# Altium schematic sheet BlockPowerSupply.SchDoc: Block_PowerSupply
size A3; Organization: Institut d'Automatisation Industrielle; SheetNumber: 3; SheetTotal: 8; SVN: OUI; CurrentTime: 6; CurrentDate: 5; DocumentFullPathAndName: 8; DocumentName: 9; ModifiedDate: 13; ProjectName: <projet>
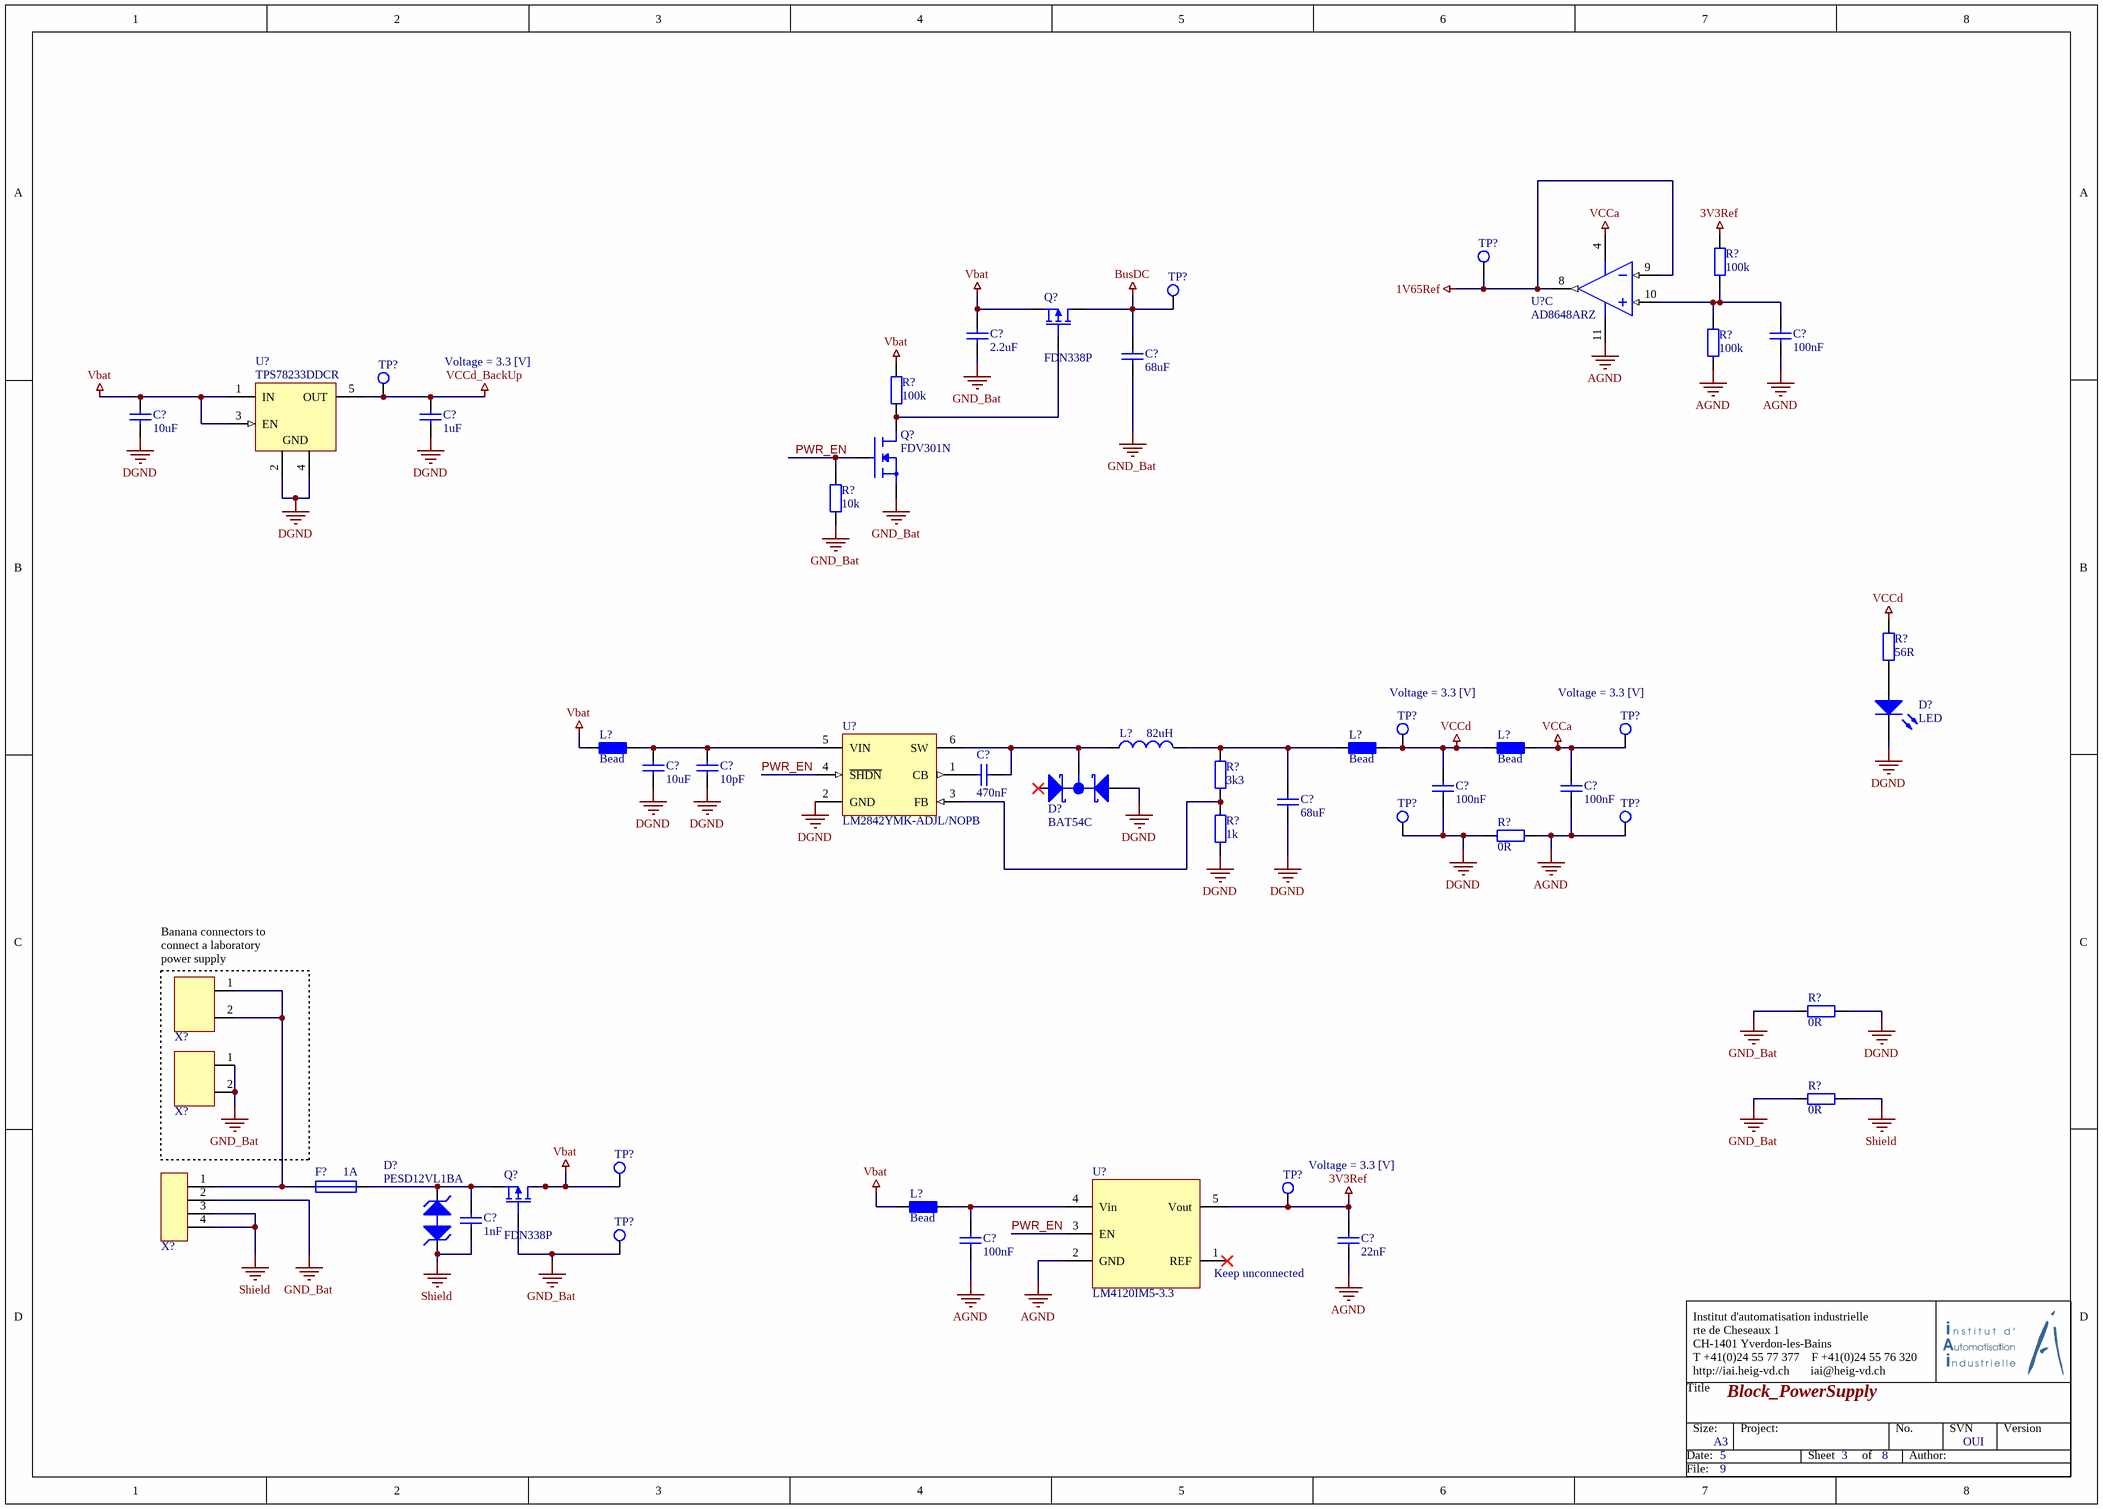
[diagram p0: BlockPowerSupply.SchDoc]

## Parts
(Parts that share a designator on the sheet are numbered #1, #2 ... from top to bottom, then left to right.)
C?#1  2.2uF  [CAPC2012N]
C?#2  100nF  [CAPC2012N]
C?#3  68uF  [CAP1206]
C?#4  10uF  [CAP1206]
C?#5  1uF  [CAPC2012N]
C?#6  470nF  [CAPC2012N]
C?#7  10uF  [CAP1206]
C?#8  10pF  [CAPC2012N]
C?#9  100nF  [CAPC2012N]
C?#10  100nF  [CAPC2012N]
C?#11  68uF  [CAP1206]
C?#12  1nF  [CAPC2012N]
C?#13  100nF  [CAPC2012N]
C?#14  22nF  [CAPC2012N]
D?#1  LED  [LED2012N]
D?#2  BAT54C  [SOT23-3N]
D?#3  PESD12VL1BA  [SOD323]
F?  1A  [RESC2012N]
L?#1  Bead  [RESC2012N]
L?#2  82uH  [SRR1260A-820MC]
L?#3  Bead  [RESC2012N]
L?#4  Bead  [RESC2012N]
L?#5  Bead  [RESC2012N]
Q?#1  FDN338P  [SOT23-3N]
Q?#2  FDV301N  [SOT23-3N]
Q?#3  FDN338P  [SOT23-3N]
R?#1  100k  [RESC2012N]
R?#2  100k  [RESC2012N]
R?#3  100k  [RESC2012N]
R?#4  10k  [RESC2012N]
R?#5  56R  [RESC2012N]
R?#6  3k3  [RESC2012N]
R?#7  1k  [RESC2012N]
R?#8  0R  [RESC2012N]
R?#9  0R  [RESC2012N]
R?#10  0R  [RESC2012N]
TP?#1  TP  [Testpoint]  (value not drawn)
TP?#2  TP  [Testpoint]  (value not drawn)
TP?#3  TP  [Testpoint]  (value not drawn)
TP?#4  TP  [Testpoint]  (value not drawn)
TP?#5  TP  [Testpoint]  (value not drawn)
TP?#6  TP  [Testpoint]  (value not drawn)
TP?#7  TP  [Testpoint]  (value not drawn)
TP?#8  TP  [Testpoint]  (value not drawn)
TP?#9  TP  [Testpoint]  (value not drawn)
TP?#10  TP  [Testpoint]  (value not drawn)
U?#1  AD8648ARZ  [ADI-R-14_M]  (part C of 4)
U?#2  TPS78233DDCR  [SOT-23-5]
U?#3  LM2842YMK-ADJL/NOPB  [SOT-23-6]
U?#4  LM4120IM5-3.3  [SOT-23-5]
X?#1  Fiche Banane Rouge 4mm  [BANANE]  (value not drawn)
X?#2  Fiche Banane Noire 4mm  [BANANE]  (value not drawn)
X?#3  MicroMatch4p  [MicroMatch4p]  (value not drawn)

## Nets
1V65Ref: TP?#1.1 U?#1.8(OUT_C) U?#1.9(-IN_C)
3V3Ref: C?#14.2 R?#1.2 TP?#9.1 U?#4.5(Vout)
AGND: C?#2.1 C?#10.1 C?#13.1 C?#14.1 R?#2.1 R?#8.2 TP?#7.1 U?#1.11(-V) U?#4.2(GND)
BusDC: C?#3.2 Q?#1.3(D) TP?#2.1
DGND: C?#4.1 C?#5.1 C?#7.1 C?#8.1 C?#9.1 C?#11.1 D?#1.2(K) D?#2.2(A2) R?#7.2 R?#8.1 R?#9.2 TP?#6.1 U?#2.2(GND) U?#2.4(GND) U?#3.2(GND)
GND_Bat: C?#1.1 C?#3.1 Q?#2.2(S) Q?#3.1(G) R?#4.1 R?#9.1 R?#10.1 TP?#10.1 X?#2.1 X?#2.2 X?#3.2
Shield: C?#12.1 D?#3.1(K1) R?#10.2 X?#3.3 X?#3.4
Vbat: C?#1.2 C?#4.2 L?#1.1 L?#5.1 Q?#1.2(S) Q?#3.3(D) R?#3.2 TP?#8.1 U?#2.1(IN) U?#2.3(EN)
VCCa: C?#10.2 L?#4.2 TP?#5.1 U?#1.4(+V)
VCCd: C?#9.2 L?#3.2 L?#4.1 R?#5.2 TP?#4.1
VCCd_BackUp: C?#5.2 TP?#3.1 U?#2.5(OUT)
PWR_EN: Q?#2.1(G) R?#4.2 U?#3.4(~{SHDN}) U?#4.3(EN)
NetC?#2_2: C?#2.2 R?#1.1 R?#2.2 U?#1.10(+IN_C)
NetC?#6_1: C?#6.1 U?#3.1(CB)
NetC?#6_2: C?#6.2 D?#2.3(K) L?#2.1 U?#3.6(SW)
NetC?#7_2: C?#7.2 C?#8.2 L?#1.2 U?#3.5(VIN)
NetC?#11_2: C?#11.2 L?#2.2 L?#3.1 R?#6.2
NetC?#12_2: C?#12.2 D?#3.2(K2) F?.2 Q?#3.2(S)
NetC?#13_2: C?#13.2 L?#5.2 U?#4.4(Vin)
NetD?#1_1: D?#1.1(A) R?#5.1
NetF?_1: F?.1 X?#1.1 X?#1.2 X?#3.1
NetQ?#1_1: Q?#1.1(G) Q?#2.3(D) R?#3.1
NetR?#6_1: R?#6.1 R?#7.1 U?#3.3(FB)

Not connected (* = marked no-connect by the designer): D?#2 1(A1)*; U?#4 1(REF)*

## Notes on the sheet
- Voltage = 3.3 [V]
- (near TP?#5) Voltage = 3.3 [V]
- (near X?#1) Banana connectors to connect a laboratory power supply
- (near TP?#9) Voltage = 3.3 [V]
- (near U?#4) Keep unconnected
- Title
- Institut d'automatisation industrielle
  rte de Cheseaux 1
  CH-1401 Yverdon-les-Bains
  T +41(0)24 55 77 377    F +41(0)24 55 76 320
  http://iai.heig-vd.ch       iai@heig-vd.ch
- Date:
- Size:
- A3
- Project:
- Sheet
- of
- No.
- Author:
- SVN
- Version
- File:

## Library data of the parts
C?#1 = Cap_2.2uF: Capacitor; Value: 2.2uF; Supplier 1: Digi-Key; Supplier Part Number 1: 490-10744-1-ND
C?#2 C?#9 C?#10 C?#13 = Cap_100nF: Capacitor; Value: 100nF; Supplier 1: Digi-Key; Supplier Part Number 1: 478-1395-1-ND
C?#3 C?#11 = Cap_68uF: Capacitor; Value: 68uF; Supplier 1: Digi-Key; Supplier Part Number 1: 445-11687-1-ND
C?#4 C?#7 = Cap_10uF: Capacitor; Value: 10uF; Supplier 1: Digi-Key; Supplier Part Number 1: 445-7886-1-ND
C?#5 = Cap_1uF: Capacitor; Value: 1uF; Supplier 1: Digi-Key; Supplier Part Number 1: 490-10743-1-ND
C?#6 = Cap_470nF: Capacitor; Value: 470nF; Supplier 1: Digi-Key; Supplier Part Number 1: 399-8100-1-ND
C?#8 = Cap_10pF: Capacitor; Value: 10pF; Supplier 1: Digi-Key; Supplier Part Number 1: 311-1099-1-ND
C?#12 = Cap_1nF: Capacitor; Value: 1nF; Supplier 1: Digi-Key; Supplier Part Number 1: 311-1127-1-ND
C?#14 = Cap_22nF: Capacitor; Value: 22nF; Supplier 1: Digi-Key; Supplier Part Number 1: 311-1138-1-ND
D?#1 = LED_Green_0805: Supplier 1: Digi-Key; Supplier Part Number 1: 475-1410-1-ND
F? = Fuse_1A: MFU0805FF01000P100; Supplier 1: Digi-Key; Supplier Part Number 1: MFU08051.00CT-ND; Value: 1A
L?#2 = SRR1260A-820M: Value: 82uH; Supplier 1: Digi-Key; Supplier Part Number 1: SRR1260A-820MCT-ND
Q?#1 Q?#3 = FDN338P: MOSFet P; Supplier 1: Digi-Key; Supplier Part Number 1: FDN338PCT-ND; Value: FDN338P
R?#1-R?#3 = Res_100k: Resistor; Value: 100k; Supplier 1: Digi-Key; Supplier Part Number 1: 311-100KCRCT-ND
R?#4 = Res_10k: Resistor; Value: 10k; Supplier 1: Digi-Key; Supplier Part Number 1: 311-10.0KCRCT-ND
R?#5 = Res_56R: Resistor; Value: 56R; Supplier 1: Digi-Key; Supplier Part Number 1: 311-56.0CRCT-ND
R?#6 = Res_3k3: Resistor; Value: 3k3; Supplier 1: Digi-Key; Supplier Part Number 1: 311-3.30KCRCT-ND
R?#7 = Res_1k: Resistor; Value: 1k; Supplier 1: Digi-Key; Supplier Part Number 1: 311-1.00KCRCT-ND
R?#8-R?#10 = Res_0R: Resistor; Value: 0R; Supplier 1: Digi-Key; Supplier Part Number 1: 311-0.0ARCT-ND
TP?#1-TP?#10 = TP: =Value; Supplier 1: Digi-Key; Supplier Part Number 1: 36-5006-ND
U?#1 = AD8648ARZ: Quad Channel Wide Bandwidth Operational Amplifier, 22 MHz BW, 12 V/us SR, Industrial, 14-pin SOIC (R-14), Tube; Generic Part Number: AD8648; Manufacturer: Analog Devices; Amplifiers Per Package: 4; Automotive Qualified: Yes; Input Bias Current: 200fA; Input Offset Voltage: 700uV; Iq/Amp: 2mA; Slew Rate: 12V/us; Small Signal Bandwidth: 22MHz; V Span Max: 5.5V; V Span Min: 2.7V; DatasheetVersion: Rev. D; PackageVersion: 060606-A; PackageReference: R-14; PackageDescription: 14-Pin Standard Small Outline Package, Body 8.65 x 3.9 mm, Pitch 1.27 mm; Mounting Technology: Surface Mount; Code_JEDEC: MS-012-AB; PartNumber: AD8648ARZ; ComponentLink1Description: Manufacturer URL; ComponentLink1URL: http://www.analog.com/en/index.html; ComponentLink2Description: Datasheet; ComponentLink2URL: http://www.analog.com/static/imported-files/data_sheets/AD8646_8647_8648.pdf; ComponentLink3Description: Package Specification; ComponentLink3URL: http://www.analog.com/static/imported-files/packages/PKG_PDF/SOIC_Narrow%20(R)/R_14.pdf; Supplier 1: Digi-Key; Supplier Part Number 1: AD8648ARZ-ND
U?#2 = TPS78233DDCR: Single Output LDO, 150 mA, Fixed 3.3 V Output, 2.2 to 5.5 V Input, with 0.5 uA Quiescent Current, 5-pin SOT (DDC), -40 to 125 degC, Green (RoHS & no Sb/Br); Manufacturer: Texas Instruments; Accuracy(%): 3; Dynamic Voltage Scaling: TRUE; Fixed Output Options(V): 3.3; Iout(Max)(A): 0.15; Iq(Typ)(mA): 0.0005; Rating: Catalog; SubFamily: Single Channel LDO; Vdo(Typ)(mV): 130; Vin(Max)(V): 5.5; Vin(Min)(V): 2.2; DatasheetVersion: SBVS115B; PackageVersion: 4204403-2/E; PackageReference: DDC5; PackageDescription: 5-Pin Plastic Small Outline, Body 2.9 x 1.6 mm, 0.95 mm Pitch; Supplier 1: Digi-Key; Supplier Part Number 1: 296-24059-1-ND; Eco-Plan: Green (RoHS & no Sb/Br); Vout Adj(Max)(V): 3.3; Vout Adj(Min)(V): 3.3; Mounting Technology: Surface Mount; Code_JEDEC: MO-193; PartNumber: TPS78233DDCR; ComponentLink1Description: Manufacturer URL; ComponentLink1URL: http://www.ti.com/; ComponentLink2Description: Datasheet; ComponentLink2URL: http://www.ti.com/general/docs/lit/getliterature.tsp?genericPartNumber=TPS78233&fileType=pdf; ComponentLink3Description: Package Specification; ComponentLink3URL: http://www.ti.com/litv/pdf/mpds123d
U?#3 = LM2842YMK-ADJL/NOPB: 600 mA up to 42V Input Step-Down DC/DC Regulator, Thin 6-pin SOT23, Pb-Free, 1000 Reel; Supplier 1: Digi-Key; Supplier Part Number 1: LM2842YMK-ADJL/NOPBCT-ND
D?#2 = BAT54C: Supplier 1: Digi-Key; Supplier Part Number 1: BAT54CLT1GOSCT-ND
D?#3 = PESD12VL1BA: Supplier 1: Digi-Key; Supplier Part Number 1: 568-4022-1-ND
L?#1 L?#3-L?#5 = Bead: Value: Bead; Supplier 1: Digi-Key; Supplier Part Number 1: 240-2399-1-ND
Q?#2 = FDV301N: Value: FDV301N; Supplier 1: Digi-Key; Supplier Part Number 1: FDV301NCT-ND
U?#4 = LM4120IM5-3.3: Supplier 1: Digi-Key; Supplier Part Number 1: LM4120IM5-3.3/NOPBCT-ND
X?#1 = Fiche Banane Rouge 4mm: Supplier 1: Farnell; Supplier Part Number 1: 1698982
X?#2 = Fiche Banane Noire 4mm: Supplier 1: Farnell; Supplier Part Number 1: 1698983
X?#3 = MicroMatch4p: Supplier 1: Digi-Key; Supplier Part Number 1: A107022CT-ND